# EasyEDA schematic SCH_robot_2026-01-04.json
TITLE: Sheet_1; REV: 1.0; Date: 2026-01-03; Sheet: 1/1; Company: Your Company
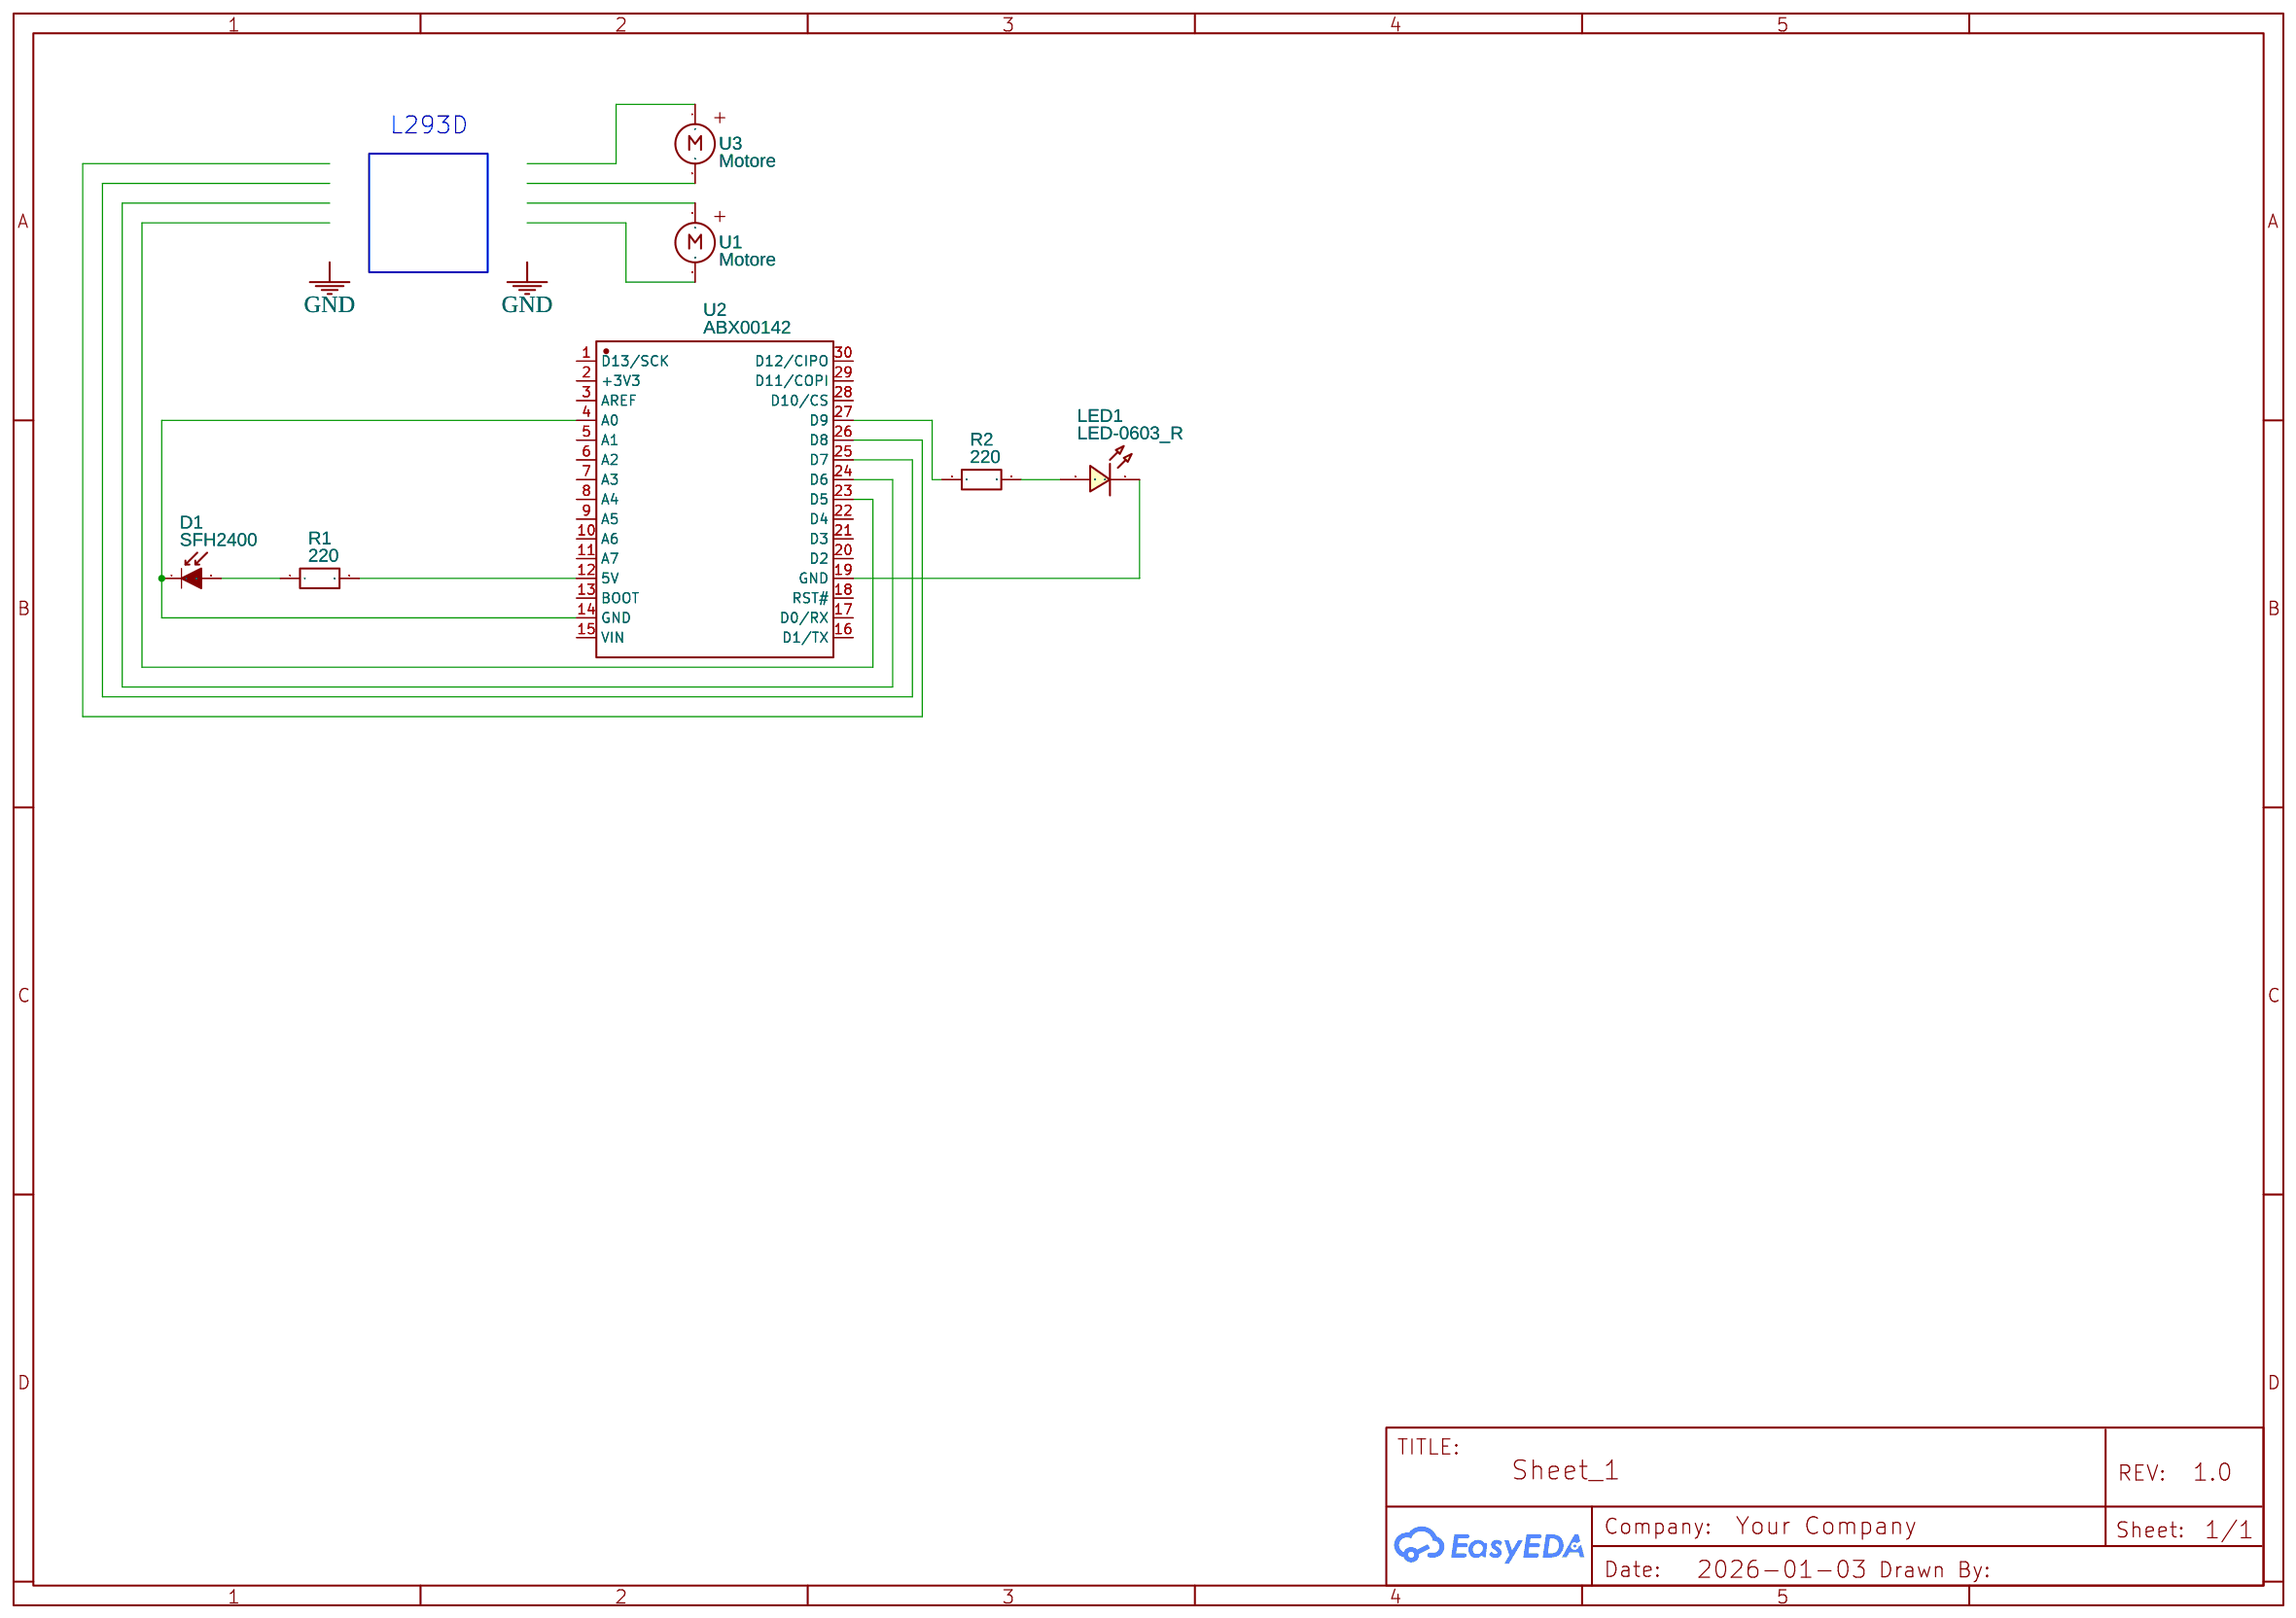
[diagram p0: schematic sheet]

## Parts
D1  SFH2400  [PHOTODIODE_SMD-SMARTDIL]
LED1  LED-0603_R  [LED0603_RED]
R1  220  [R0603]
R2  220  [R0603]
U1  Motore  [MOTOREDUCTOR CON SOPORTE]
U2  ABX00142  [ARDUINO-TH_L43.2-W17.8-P2.54-LS15.24-BL]
U3  Motore  [MOTOREDUCTOR CON SOPORTE]

## Library data of the parts
D1 = SFH2400: Contributor: KiCAD; license: https://www.gnu.org/licenses/lgpl-2.1.html
LED1 = LED-0603_R: Manufacturer: EVERLIGHT(台湾亿光); Manufacturer Part: 19-217/R6C-AL1M2VY/3T; Supplier Part: C72044; Supplier: LCSC; Contributor: LCEDA_01
R1 R2 = R_0603_EU: Contributor: LCEDA_Lib
U1 U3 = Motore: Contributor: Junikos
U2 = ABX00142: Supplier: LCSC; Supplier Part: C9900245380; Manufacturer: null

## Nets
Net-(D1-1): D1.1(K) U2.4(A0) U2.14(GND)
Net-(D1-2): D1.2(A) R1.1
Net-(LED1-1): LED1.1 R2.2
Net-(LED1-2): LED1.2 U2.19(GND)
Net-(R1-2): R1.2 U2.12(5V)
Net-(R2-1): R2.1 U2.27(D9)

Not connected (* = marked no-connect by the designer): U1 1 2; U2 1(D13/SCK) 2(+3V3) 3(AREF) 5(A1) 6(A2) 7(A3) 8(A4) 9(A5) 10(A6) 11(A7) 13(BOOT) 15(VIN) 16(D1/TX) 17(D0/RX) 18(RST#) 20(D2) 21(D3) 22(D4) 23(D5) 24(D6) 25(D7) 26(D8) 28(D10/CS) 29(D11/COPI) 30(D12/CIPO); U3 1 2

## Notes on the sheet
- L293D
